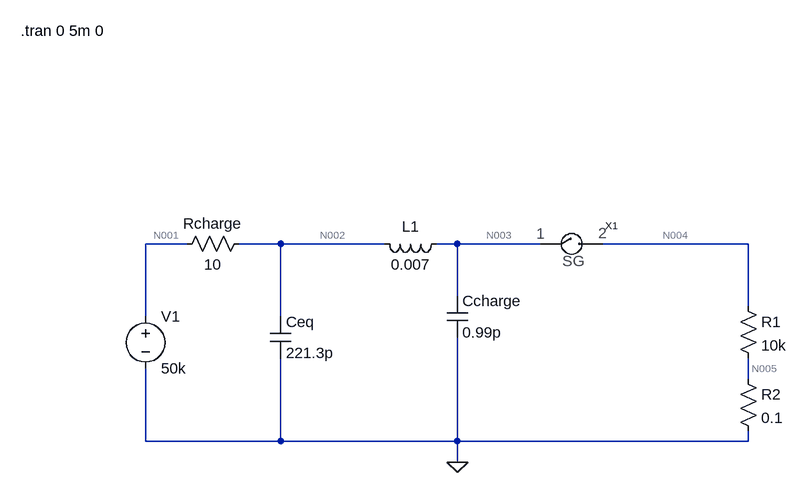
[diagram p0: schematic sgmodel_marxgenerator.asc]
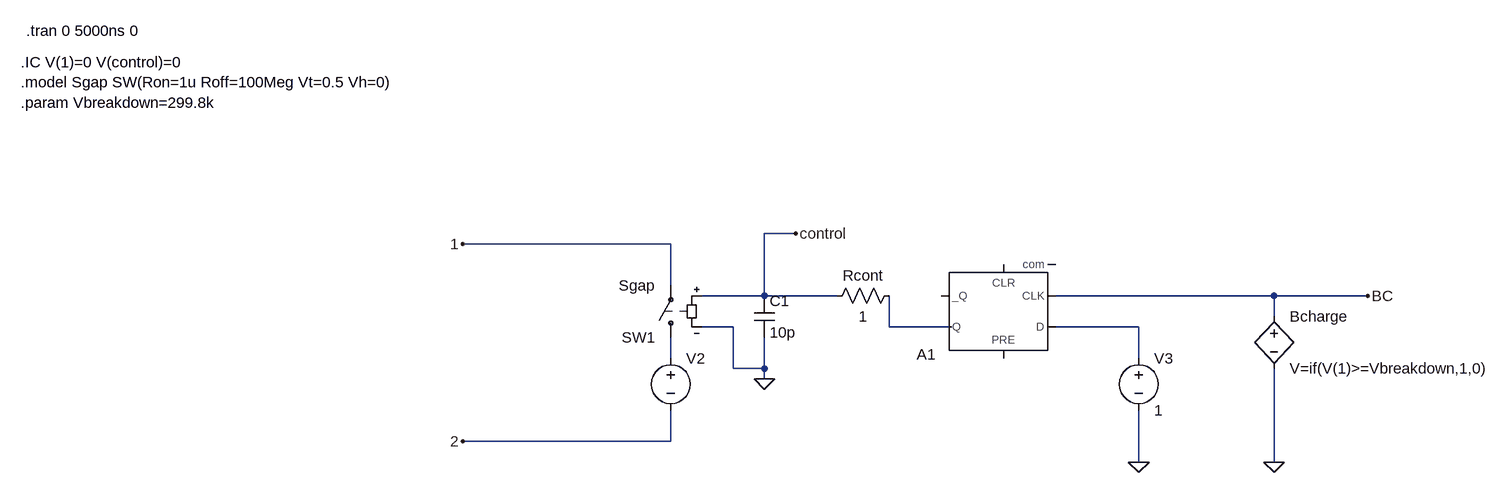
[diagram p1: sub-circuit sg_model.asc]
sgmodel_marxgenerator.asc, the LTspice schematic file:
Version 4
SHEET 1 2544 680
WIRE 480 0 416 0
WIRE 624 0 560 0
WIRE 784 0 624 0
WIRE 896 0 864 0
WIRE 1024 0 896 0
WIRE 1344 0 1120 0
WIRE 896 80 896 0
WIRE 1344 96 1344 0
WIRE 416 112 416 0
WIRE 624 112 624 0
WIRE 1344 208 1344 176
WIRE 416 304 416 192
WIRE 624 304 624 176
WIRE 624 304 416 304
WIRE 896 304 896 144
WIRE 896 304 624 304
WIRE 1344 304 1344 288
WIRE 1344 304 896 304
WIRE 896 336 896 304
FLAG 896 336 0
SYMBOL voltage 416 96 R0
WINDOW 123 0 0 Left 0
WINDOW 39 0 0 Left 0
SYMATTR InstName V1
SYMATTR Value 50k
SYMBOL cap 880 80 R0
SYMATTR InstName Ccharge
SYMATTR Value 0.99p
SYMBOL ind 880 -16 R90
WINDOW 0 5 56 VBottom 2
WINDOW 3 32 56 VTop 2
SYMATTR InstName L1
SYMATTR Value 0.007
SYMBOL res 1328 80 R0
SYMATTR InstName R1
SYMATTR Value 10k
SYMBOL sg_model 1072 0 R0
SYMATTR InstName X1
SYMBOL cap 608 112 R0
SYMATTR InstName Ceq
SYMATTR Value 221.3p
SYMBOL res 576 -16 R90
WINDOW 0 0 56 VBottom 2
WINDOW 3 32 56 VTop 2
SYMATTR InstName Rcharge
SYMATTR Value 10
SYMBOL res 1328 192 R0
SYMATTR InstName R2
SYMATTR Value 0.1
TEXT 224 -328 Left 2 !.tran 0 5m 0

sg_model.asc, the sub-circuit schematic file:
Version 4
SHEET 1 1600 680
WIRE 464 64 416 64
WIRE 272 80 -48 80
WIRE 272 144 272 80
WIRE 416 160 416 64
WIRE 416 160 320 160
WIRE 528 160 416 160
WIRE 1200 160 864 160
WIRE 1344 160 1200 160
WIRE 1200 192 1200 160
WIRE 368 208 320 208
WIRE 608 208 608 160
WIRE 704 208 608 208
WIRE 992 208 864 208
WIRE 272 256 272 224
WIRE 992 256 992 208
WIRE 368 272 368 208
WIRE 416 272 416 224
WIRE 416 272 368 272
WIRE 416 288 416 272
WIRE 272 384 272 336
WIRE 272 384 -48 384
WIRE 992 416 992 336
WIRE 1200 416 1200 272
FLAG 416 288 0
FLAG 992 416 0
FLAG 1200 416 0
FLAG 464 64 control
FLAG 1344 160 BC
FLAG -48 80 1
FLAG -48 384 2
SYMBOL voltage 992 240 R0
WINDOW 123 0 0 Left 0
WINDOW 39 0 0 Left 0
SYMATTR InstName V3
SYMATTR Value 1
SYMBOL voltage 272 240 R0
WINDOW 123 0 0 Left 0
WINDOW 39 24 44 Left 2
SYMATTR InstName V2
SYMATTR Value ""
SYMBOL res 624 144 R90
WINDOW 0 0 56 VBottom 2
WINDOW 3 32 56 VTop 2
SYMATTR InstName Rcont
SYMATTR Value 1
SYMBOL cap 400 160 R0
SYMATTR InstName C1
SYMATTR Value 10p
SYMBOL bv 1200 176 R0
SYMATTR InstName Bcharge
SYMATTR Value V=if(V(1)>=Vbreakdown,1,0)
SYMBOL Digital\\dflop 784 256 R180
SYMATTR InstName A1
SYMBOL sw 272 240 R180
SYMATTR InstName SW1
SYMATTR Value Sgap
TEXT -728 -200 Left 2 !.IC V(1)=0 V(control)=0\n.model Sgap SW(Ron=1u Roff=100Meg Vt=0.5 Vh=0)\n.param Vbreakdown=299.8k
TEXT -720 -248 Left 2 !.tran 0 5000ns 0

The netlist it stands for:
* sgmodel_marxgenerator.asc
V1 N001 0 50k
Ccharge N003 0 0.99p
L1 N003 N002 0.007
R1 N004 N005 10k
XX1 N003 N004 sg_model
Ceq N002 0 221.3p
Rcharge N002 N001 10
R2 N005 0 0.1

* block symbol definitions
.subckt sg_model 1 2
V3 N002 0 1
V2 N003 2
Rcont N001 control 1
C1 control 0 10p
Bcharge BC 0 V=if(V(1)>=Vbreakdown,1,0)
A1 N002 0 BC 0 0 0 N001 0 DFLOP
SW1 N003 1 control 0 Sgap
.IC V(1)=0 V(control)=0
.model Sgap SW(Ron=1u Roff=100Meg Vt=0.5 Vh=0)
.param Vbreakdown=299.8k
.tran 0 5000ns 0
.ends sg_model

.tran 0 5m 0
.backanno
.end

* Results of the author's LTspice run, read from the files saved beside the schematic
* Operating Point, zero values left out:
*   V(n001) = 50 kV
*   V(n002) = 5 V
*   I(L1) = -5 kA
*   I(Rcharge) = -5 kA
*   I(V1) = -5 kA
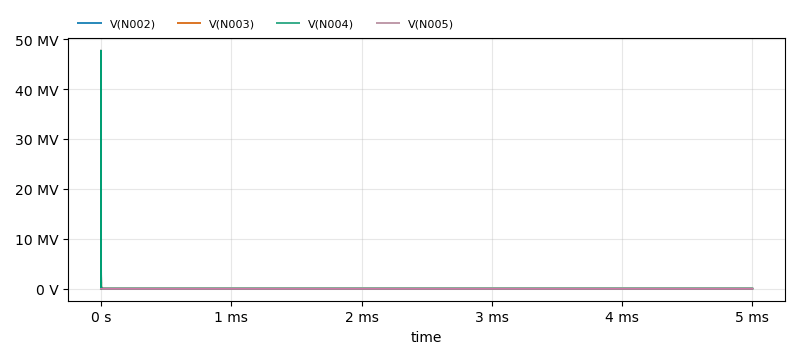
[diagram p2: Transient Analysis of sgmodel_marxgenerator.asc, plotted from the saved traces]
* Transient Analysis, 1 run:
*   V(N002): min 5 V, max 49.95 kV, average 49.94 kV, rms 49.94 kV, last 49.95 kV
*   V(N003): min 0 V, max 47.57 MV, average 57.1 kV, rms 431.3 kV, last 49.95 kV
*   V(N004): min 0 V, max 47.75 MV, average 56.94 kV, rms 425.1 kV, last 49.95 kV
*   V(N005): min 0 V, max 475.7 V, average 571 mV, rms 4.313 V, last 499.5 mV